# EAGLE design main-v3 (EAGLE 6.2)
AUTHOR: Chaiporn Jaikaeo; REV: 1
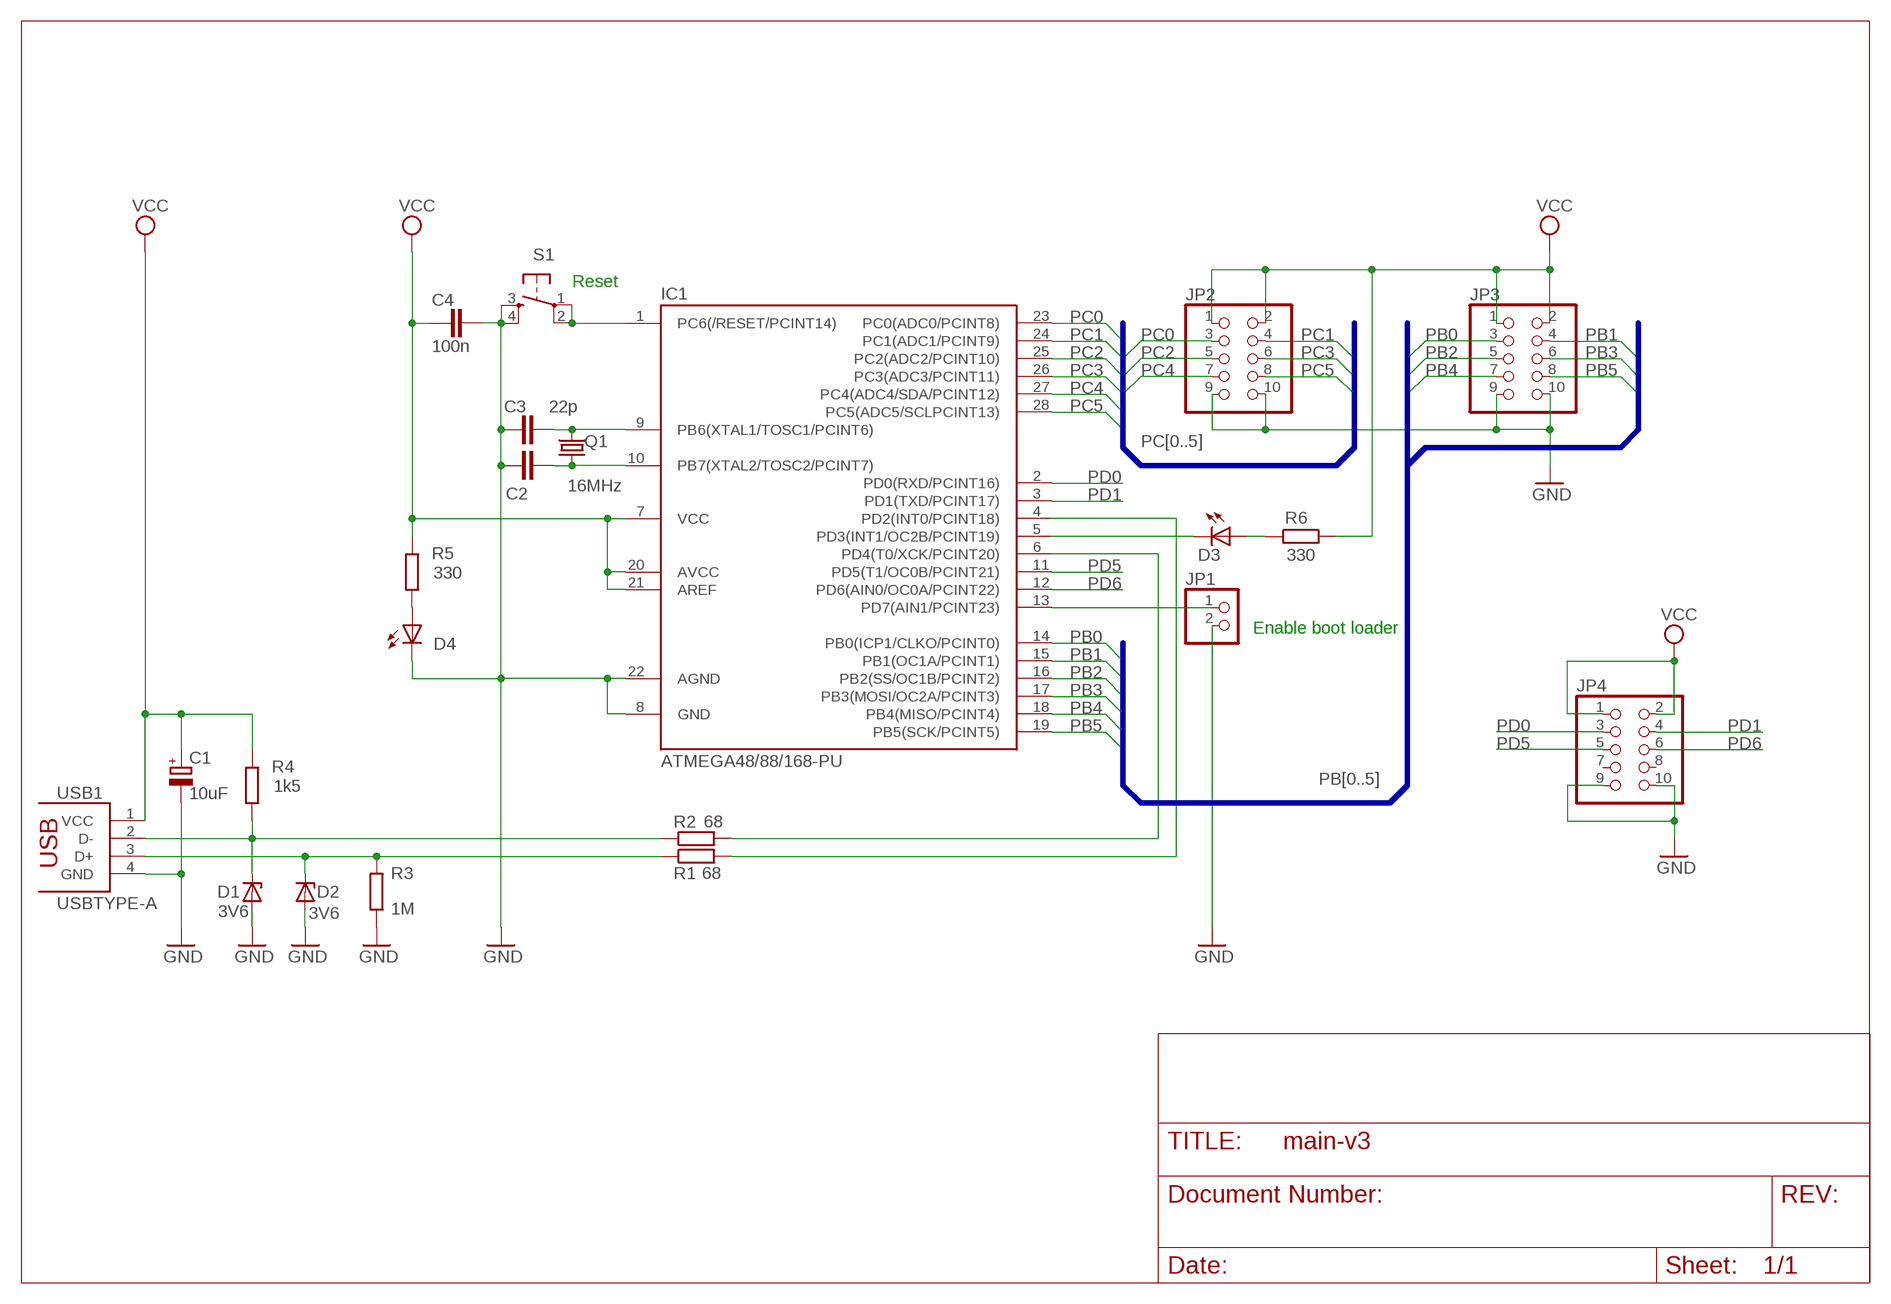
[diagram p0: schematic, sheet 1]

## Parts
C1  10uF  CPOL-EUE2,5-6E  [E2,5-6E]
C2  22p  C-EU025-024X044  [C025-024X044]
C3  22p  C-EU025-024X044  [C025-024X044]
C4  100n  C-EU050-024X044  [C050-024X044]
D1  3V6  ZENER-DIODEDO34-7  [DO34Z7]
D2  3V6  ZENER-DIODEDO34-7  [DO34Z7]
D3  LED3MM  [LED3MM]
D4  LED3MM  [LED3MM]
IC1  ATMEGA48/88/168-PU  [DIL28-3]
JP1  PINHD-1X2  [1X02]
JP2  HEADER-2X5  [2X05]
JP3  HEADER-2X5  [2X05]
JP4  HEADER-2X5  [2X05]
Q1  16MHz  CRYSTALHC49S  [HC49/S]
R1  68  R-EU_0207/10  [0207/10]
R2  68  R-EU_0207/10  [0207/10]
R3  1M  R-EU_0207/10  [0207/10]
R4  1k5  R-EU_0207/10  [0207/10]
R5  330  R-EU_0207/10  [0207/10]
R6  330  R-EU_0207/10  [0207/10]
S1  DTS-6  [DTS-6]
USB1  USBTYPE-A  [USBTYPE-A]

## Nets
D+: D2.C R1.1 R3.2 USB1.3(D+)
D-: D1.C R2.1 R4.2 USB1.2(D-)
GND [power]: C1.- C2.1 C3.1 C4.2 D1.A D2.A D4.K(C) IC1.8(GND) IC1.22(AGND) JP1.2 JP2.9 JP2.10 JP3.9 JP3.10 JP4.9 JP4.10 R3.1 S1.3 S1.4 USB1.4(GND)
N$1: IC1.4(PD2(INT0/PCINT18)) R1.2
N$2: IC1.1(PC6(/RESET/PCINT14)) S1.1 S1.2
N$3: IC1.6(PD4(T0/XCK/PCINT20)) R2.2
N$4: IC1.13(PD7(AIN1/PCINT23)) JP1.1
N$5: D3.K(C) IC1.5(PD3(INT1/OC2B/PCINT19))
N$6: D4.A R5.2
N$7: D3.A R6.2
N$9: C2.2 IC1.10(PB7(XTAL2/TOSC2/PCINT7)) Q1.1
N$10: C3.2 IC1.9(PB6(XTAL1/TOSC1/PCINT6)) Q1.2
PB0: IC1.14(PB0(ICP1/CLKO/PCINT0)) JP3.3
PB1: IC1.15(PB1(OC1A/PCINT1)) JP3.4
PB2: IC1.16(PB2(SS/OC1B/PCINT2)) JP3.5
PB3: IC1.17(PB3(MOSI/OC2A/PCINT3)) JP3.6
PB4: IC1.18(PB4(MISO/PCINT4)) JP3.7
PB5: IC1.19(PB5(SCK/PCINT5)) JP3.8
PC0: IC1.23(PC0(ADC0/PCINT8)) JP2.3
PC1: IC1.24(PC1(ADC1/PCINT9)) JP2.4
PC2: IC1.25(PC2(ADC2/PCINT10)) JP2.5
PC3: IC1.26(PC3(ADC3/PCINT11)) JP2.6
PC4: IC1.27(PC4(ADC4/SDA/PCINT12)) JP2.7
PC5: IC1.28(PC5(ADC5/SCLPCINT13)) JP2.8
PD0: IC1.2(PD0(RXD/PCINT16)) JP4.3
PD1: IC1.3(PD1(TXD/PCINT17)) JP4.4
PD5: IC1.11(PD5(T1/OC0B/PCINT21)) JP4.5
PD6: IC1.12(PD6(AIN0/OC0A/PCINT22)) JP4.6
VCC [power]: C1.+ C4.1 IC1.7(VCC) IC1.20(AVCC) IC1.21(AREF) JP2.1 JP2.2 JP3.1 JP3.2 JP4.1 JP4.2 R4.1 R5.1 R6.1 USB1.1(VCC)
Unconnected: JP4.7 JP4.8

## Buses
PC[0..5]
PB[0..5]

## Notes on the sheet
- Reset
- Enable boot loader

## Library data of the parts
C1 = rcl:CPOL-EU: POLARIZED CAPACITOR, European symbol
C2-C4 = rcl:C-EU: CAPACITOR, European symbol
D1 D2 = diode:ZENER-DIODE: Z-Diode
D3 D4 = led:LED: LED OSRAM: - CHIPLED LG R971, LG N971, LY N971, LG Q971, LY Q971, LO R971, LY R971 LH N974, LH R974 LS Q976, LO Q976, LY Q976 LO Q996 - Hyper CHIPLED LW Q18S LB Q993, LB Q99A, LB R99A - SideLED LS A670, LO A670, LY A670, LG A670, LP A670 LB A673, LV A673, LT A673, LW A673 LH A674 LY A675 LS A676, LA A676, LO A676, LY A676, LW A676 LS A679, LY A679, LG A679 - Hyper Micro SIDELED® LS Y876, LA Y876, LO Y876, LY Y876 LT Y87S - SmartLED LW L88C, LW L88S LB L89C, LB L89S, LG L890 LS L89K, LO L89K, LY L89K LS L896, LA L896, LO L896, LY L896 - TOPLED LS T670, LO T670, LY T670, LG T670, LP T670 LSG T670, LSP T670, LSY T670, LOP T670, LYG T670 LG T671, LOG T671, LSG T671 LB T673, LV T673, LT T673, LW T673 LH T674 LS T676, LA T676, LO T676, LY T676, LB T676, LH T676, LSB T676, LW T676 LB T67C, LV T67C, LT T67C, LS T67K, LO T67K, LY T67K, LW E67C LS E67B, LA E67B, LO E67B, LY E67B, LB E67C, LV E67C, LT E67C LW T67C LS T679, LY T679, LG T679 LS T770, LO T770, LY T770, LG T770, LP T770 LB T773, LV T773, LT T773, LW T773 LH T774 LS E675, LA E675, LY E675, LS T675 LS T776, LA T776, LO T776, LY T776, LB T776 LHGB T686 LT T68C, LB T68C - Hyper Mini TOPLED® LB M676 - Mini TOPLED Santana® LG M470 LS M47K, LO M47K, LY M47K Source: http://www.osram.convergy.de LUXEON: - LUMILED® LXK2-PW12-R00, LXK2-PW12-S00, LXK2-PW14-U00, LXK2-PW14-V00 LXK2-PM12-R00, LXK2-PM12-S00, LXK2-PM14-U00 LXK2-PE12-Q00, LXK2-PE12-R00, LXK2-PE12-S00, LXK2-PE14-T00, LXK2-PE14-U00 LXK2-PB12-K00, LXK2-PB12-L00, LXK2-PB12-M00, LXK2-PB14-N00, LXK2-PB14-P00, LXK2-PB14-Q00 LXK2-PR12-L00, LXK2-PR12-M00, LXK2-PR14-Q00, LXK2-PR14-R00 LXK2-PD12-Q00, LXK2-PD12-R00, LXK2-PD12-S00 LXK2-PH12-R00, LXK2-PH12-S00 LXK2-PL12-P00, LXK2-PL12-Q00, LXK2-PL12-R00 Source: www.luxeon.com KINGBRIGHT: KA-3528ASYC Source: www.kingbright.com
IC1 = atmega8:ATMEGA48/88/168-PU
JP1 = pinhead:PINHD-1X2: PIN HEADER
JP2-JP4 = microbuilder:HEADER-2X5: PIN HEADER
Q1 = crystal:CRYSTAL: CRYSTAL
R1-R6 = rcl:R-EU_: RESISTOR, European symbol
S1 = switch-tact:DTS-6
USB1 = USBTYPE-A:USBTYPE-A

## Net classes
0 default: width 0.254 mm
1 power: width 0.406 mm, clearance 0.203 mm

## Board
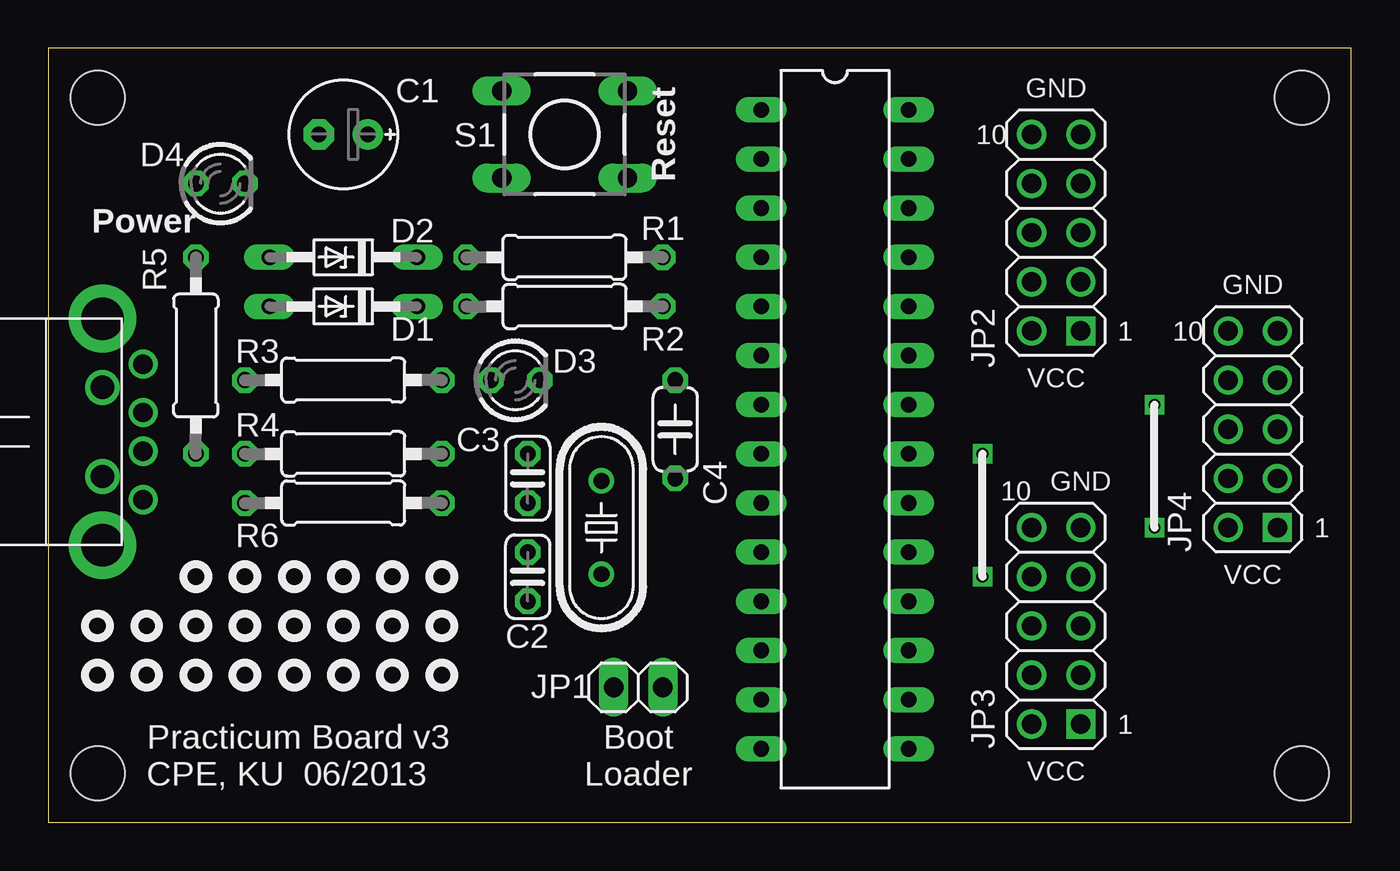
[diagram p1: board, top side]
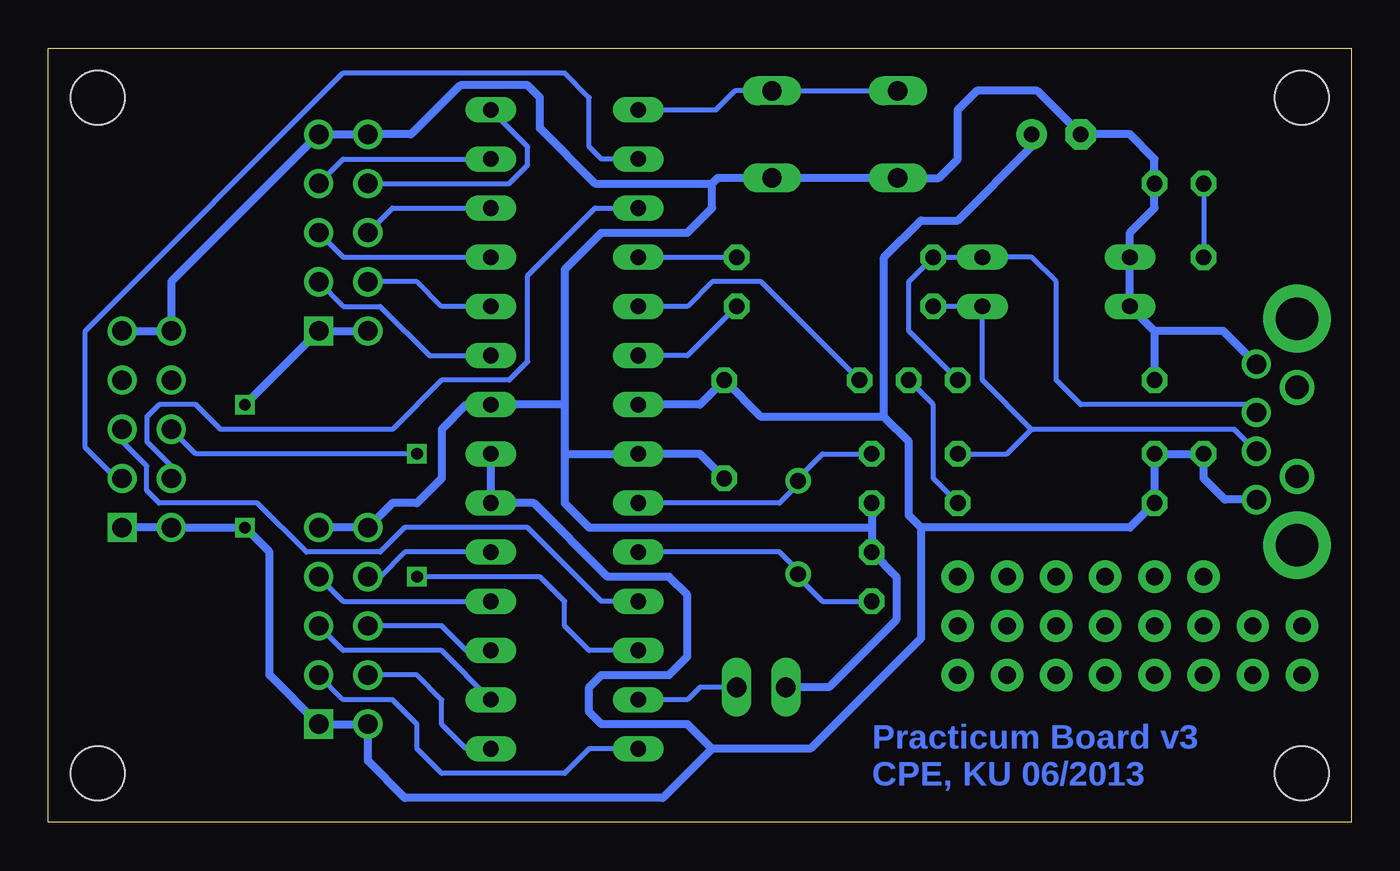
[diagram p2: board, bottom side, seen from below]

Size 67.31 x 40.01 mm. Coordinates in mm from the lower left corner, seen from the top.
Outline: 0,0 67.31,0 67.31,40.01 0,40.01 0,0
Copper layers (1*16): Top 0.035mm / dielectric 1.5mm / Bottom 0.035mm
Design rules: minimum track width 10mil, minimum drill 20mil, track to track 8mil, track to pad 8mil, pad to pad 8mil, via to via 8mil, smd to smd 8mil, copper to edge 40mil, drill to drill 8mil, minimum pad ring 10mil, minimum via ring 8mil, stop-mask expansion 4mil, vias tented up to drill 0mil, thermal gap 10mil
Holes 2.8 mm at 2.54,37.47 2.54,2.54 64.77,2.54 64.77,37.47

### Footprints (pad centres in the part's own frame; a part is rotated, then mirrored left to right if it is on the bottom)
E2,5-6E = drill 0.813 pad 1.575: + -1.27,0 | drill 0.813 pad 1.575 octagon: - 1.27,0
C025-024X044 = drill 0.813 octagon: 1 -1.27,0; 2 1.27,0
C050-024X044 = drill 0.813 octagon: 1 -2.54,0; 2 2.54,0
DO34Z7 = drill 0.813 long: A 3.81,0; C -3.81,0
LED3MM = drill 0.813 octagon: A -1.27,0; K 1.27,0
DIL28-3 = drill 0.813 long: 1 -16.51,-3.81; 2 -13.97,-3.81; 3 -11.43,-3.81; 4 -8.89,-3.81; 5 -6.35,-3.81; 6 -3.81,-3.81; 7 -1.27,-3.81; 8 1.27,-3.81; 9 3.81,-3.81; 10 6.35,-3.81; 11 8.89,-3.81; 12 11.43,-3.81; 13 13.97,-3.81; 14 16.51,-3.81; 15 16.51,3.81; 16 13.97,3.81; 17 11.43,3.81; 18 8.89,3.81; 19 6.35,3.81; 20 3.81,3.81; 21 1.27,3.81; 22 -1.27,3.81; 23 -3.81,3.81; 24 -6.35,3.81; 25 -8.89,3.81; 26 -11.43,3.81; 27 -13.97,3.81; 28 -16.51,3.81
1X02 = drill 1.016 long: 1 -1.27,0; 2 1.27,0
2X05 = drill 1 square: 1 -5.08,-1.27 | drill 1: 2 -5.08,1.27; 3 -2.54,-1.27; 4 -2.54,1.27; 5 0,-1.27; 6 0,1.27; 7 2.54,-1.27; 8 2.54,1.27; 9 5.08,-1.27; 10 5.08,1.27
HC49/S = drill 0.813: 1 -2.413,0; 2 2.413,0
0207/10 = drill 0.813 octagon: 1 -5.08,0; 2 5.08,0
DTS-6 = drill 1 long: 1 -3.25,2.25; 2 3.25,2.25; 3 -3.25,-2.25; 4 3.25,-2.25
USBTYPE-A = drill 1: 1 -2.1,9.35; 2 -2.1,6.85; 3 -2.1,4.85; 4 -2.1,2.35 | drill 2.2 pad 3.5: GND@1 0,0; GND@2 0,11.7 | drill 1.2 pad 1.6: S1 0,3.55; S2 0,8.15

### Placement (x,y rotation side)
C1  15.24,35.56 180 top
C2  24.77,12.7 270 top
C3  24.77,17.78 90 top
C4  32.38,20.32 270 top
D1  15.24,26.67 180 top
D2  15.24,29.21 180 top
D3  24.13,22.86 0 top
D4  8.89,33.02 0 top
IC1  40.64,20.32 270 top
JP1  30.48,6.99 180 top
JP2  52.07,30.48 90 top
JP3  52.07,10.16 90 top
JP4  62.23,20.32 90 top
Q1  28.57,15.24 90 top
R1  26.67,29.21 0 top
R2  26.67,26.67 0 top
R3  15.24,22.86 0 top
R4  15.24,19.05 0 top
R5  7.62,24.13 90 top
R6  15.24,16.51 0 top
S1  26.67,35.56 0 top
USB1  2.79,26.04 180 top

### Tracks (layer width: path | path; a pad name or v marks a point on that pad's centre or on a via)
D+
  Bottom 0.254: USB1.3 5.3,21.59 13.97,21.59 15.24,22.86 15.24,27.94 16.51,29.21 D2.C R1.1 22.86,27.94 22.86,25.4 R3.2
D-
  Bottom 0.254: R2.1 D1.C 19.05,22.86 16.51,20.32 | USB1.2 6.03,20.32 16.51,20.32 | R4.2 17.78,19.05 16.51,20.32
GND
  Bottom 0.406: C3.1 24.77,15.24 | 24.77,15.24 C2.1 23.5,12.7 23.5,10.48 26.99,6.99 JP1.2 | JP3.9 JP3.10 49.53,16.51 48.26,16.51 46.99,17.78 46.99,20.32 45.72,21.59 IC1.22 40.64,21.59 | 40.64,19.05 IC1.8 33.66,19.05 C4.2 | 24.77,15.24 39.37,15.24 40.64,16.51 40.64,19.05 | JP4.9 JP4.10 60.96,27.94 JP2.9 JP2.10 48.58,35.56 46.04,38.1 42.55,38.1 41.91,37.47 41.91,35.88 39.05,33.02 33.02,33.02 | 10.16,25.4 R3.1 | 10.16,25.4 D1.A D2.A 11.43,30.48 10.16,31.75 D4.K 10.16,34.29 11.43,35.56 C1.- 16.22,37.81 19.34,37.81 20.32,36.83 20.32,34.29 21.3,33.31 S1.3 S1.4 32.73,33.31 33.02,33.02 | USB1.4 6.61,25.4 10.16,25.4 | 40.64,21.59 40.64,28.57 38.73,30.48 34.29,30.48 33.02,31.75 33.02,33.02 | 40.64,21.59 40.64,19.05
N$1
  Bottom 0.254: IC1.4 R1.2
N$2
  Bottom 0.254: S1.1 S1.2 31.82,37.81 32.8,36.83 IC1.1
N$3
  Bottom 0.254: R2.2 34.29,24.13 IC1.6
N$4
  Bottom 0.254: JP1.1 33.66,6.99 34.29,6.35 IC1.13
N$5
  Bottom 0.254: D3.K 30.48,27.94 33.02,27.94 34.29,26.67 IC1.5
N$6
  Bottom 0.254: D4.A R5.2
N$7
  Bottom 0.254: R6.2 21.59,17.78 21.59,21.59 D3.A
N$9
  Bottom 0.254: C2.2 27.3,11.43 28.57,12.7 Q1.1 28.57,13.02 29.53,13.97 IC1.10
N$10
  Bottom 0.254: C3.2 27.3,19.05 28.57,17.78 Q1.2 28.57,17.46 29.53,16.51 IC1.9
N$11  (via drill 0.9 pad 1.68)
  other vias: 7.62,12.7 7.62,10.16 10.16,10.16 10.16,12.7 5.08,10.16 2.54,10.16 2.54,7.62 5.08,7.62 7.62,7.62 10.16,7.62 12.7,7.62 12.7,10.16 12.7,12.7 15.24,12.7 15.24,10.16 15.24,7.62 17.78,7.62 17.78,10.16 17.78,12.7 20.32,12.7 20.32,10.16 20.32,7.62
PB0
  Bottom 0.254: IC1.14 39.37,3.81 40.64,2.54 46.99,2.54 48.26,3.81 48.26,5.08 49.53,6.35 52.07,6.35 JP3.3
PB1
  Bottom 0.254: IC1.15 45.72,3.81 46.99,5.08 46.99,6.35 48.26,7.62 JP3.4
PB2
  Bottom 0.254: IC1.16 46.99,8.89 52.07,8.89 JP3.5
PB3
  Bottom 0.254: IC1.17 45.72,8.89 46.99,10.16 JP3.6
PB4
  Bottom 0.254: IC1.18 52.07,11.43 JP3.7
PB5
  Bottom 0.254: IC1.19 48.9,13.97 50.16,12.7 JP3.8
PC0
  Bottom 0.254: IC1.23 47.62,24.13 50.16,26.67 52.07,26.67 JP2.3
PC1
  Bottom 0.254: IC1.24 46.99,26.67 48.26,27.94 JP2.4
PC2
  Bottom 0.254: IC1.25 52.07,29.21 JP2.5
PC3
  Bottom 0.254: IC1.26 49.53,31.75 JP2.6
PC4
  Bottom 0.254: IC1.27 52.07,34.29 JP2.7
PC5
  Bottom 0.254: IC1.28 42.55,34.92 42.55,33.97 43.5,33.02 JP2.8
PD0
  Bottom 0.254: JP4.3 63.82,17.78 65.41,19.37 65.41,25.4 52.07,38.73 40.64,38.73 39.37,37.47 39.37,34.92 38.73,34.29 IC1.2
PD1
  Bottom 0.254: IC1.3 39.05,31.75 42.55,28.26 42.55,23.81 43.5,22.86 46.99,22.86 49.53,20.32 58.42,20.32 59.69,21.59 61.59,21.59 62.23,20.95 62.23,19.68 60.96,18.41 JP4.4
PD5
  Bottom 0.254: IC1.11 38.73,11.43 42.55,15.24 48.9,15.24 50.16,13.97 53.98,13.97 56.52,16.51 61.59,16.51 62.23,17.14 62.23,18.41 63.5,19.68 JP4.5
PD6  (via drill 0.6)
  Top 0.254: v48.26,12.7 v48.26,19.05
  Bottom 0.254: IC1.12 39.37,8.89 40.64,10.16 40.64,11.43 41.91,12.7 v48.26,12.7 | v48.26,19.05 59.69,19.05 JP4.6
VCC  (via drill 0.6)
  Top 0.406: v57.15,15.24 v57.15,21.59
  Bottom 0.406: JP2.2 JP2.1 v57.15,21.59 | IC1.21 IC1.20 42.23,16.51 38.42,12.7 35.24,12.7 34.29,11.75 34.29,8.57 35.24,7.62 38.73,7.62 39.37,6.99 39.37,5.71 38.73,5.08 34.29,5.08 33.02,3.81 | C1.+ 16.51,34.92 20.32,31.11 22.23,31.11 24.13,29.21 24.13,20.95 | USB1.1 6.53,16.68 7.62,17.78 R5.1 R4.1 R6.1 11.43,15.24 22.23,15.24 | 24.13,20.95 22.86,19.68 22.86,15.88 22.23,15.24 | 33.02,3.81 27.94,3.81 22.23,9.53 22.23,15.24 | 33.02,3.81 35.56,1.27 48.9,1.27 50.8,3.17 JP3.2 JP3.1 55.88,7.62 55.88,13.97 v57.15,15.24 JP4.2 JP4.1 | 24.13,20.95 30.48,20.95 C4.1 33.66,21.59 IC1.7

### Text on the board
Bottom: Practicum Board v3 | CPE, KU 06/2013
tPlace: GND | Reset | 10 | Power | GND | 1 | 10 | VCC | 10 | GND | 1 | VCC | Boot | 1 | Practicum Board v3 | Loader | VCC | CPE, KU 06/2013
tValues: PORTC | PORTD | PORTB